# Altium schematic sheet root.SchDoc
size A4; SheetNumber: 1; SheetTotal: 7
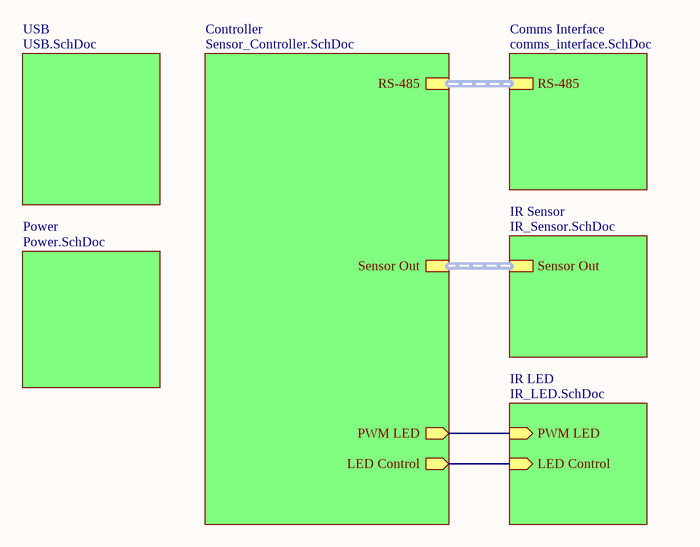
[diagram p0: root.SchDoc]

## Sub-sheets
Comms Interface = comms_interface.SchDoc: RS-485
Controller = Sensor_Controller.SchDoc: RS-485, Sensor Out, PWM LED (out), LED Control (out)
IR LED = IR_LED.SchDoc: PWM LED (in), LED Control (in)
IR Sensor = IR_Sensor.SchDoc: Sensor Out
Power = Power.SchDoc: no entries
USB = USB.SchDoc: no entries

## Nets
(unnamed): sheet Controller/PWM LED, sheet IR LED/PWM LED
(unnamed): sheet Controller/LED Control, sheet IR LED/LED Control

## Buses and harness runs
harness sheet Comms Interface/RS-485 = sheet Controller/RS-485
harness sheet Controller/Sensor Out = sheet IR Sensor/Sensor Out